# Altium schematic sheet ESP32.SchDoc
size A4; DocumentNumber: 4; SheetNumber: 4; SheetTotal: 8
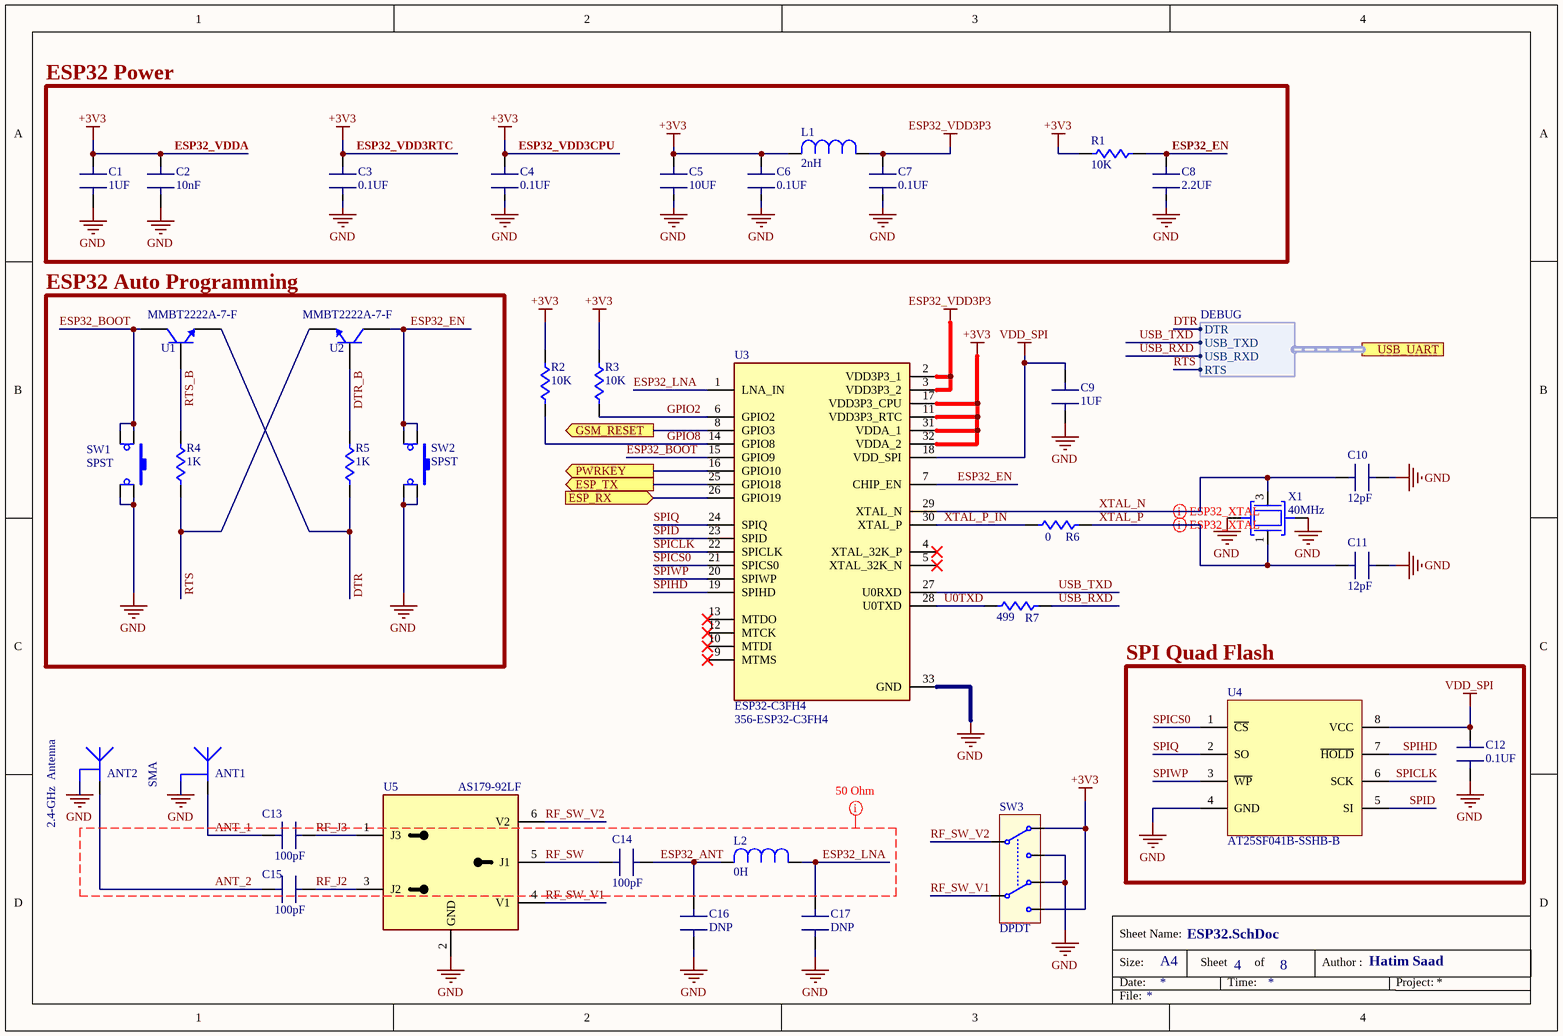
[diagram p0: ESP32.SchDoc]

## Parts
ANT1  SMA  [SMA RIGHT DIGIKEY]
ANT2  2.4-GHz  Antenna  [ANT_2.4_AN043]
C1  1UF  [CAP: 0603]
C2  10nF  [CAP: 0603]
C3  0.1UF  [CAP: 0603]
C4  0.1UF  [CAP: 0603]
C5  10UF  [CAP: 0805]
C6  0.1UF  [CAP: 0603]
C7  0.1UF  [CAP: 0603]
C8  2.2UF  [CAP: 0603]
C9  1UF  [CAP: 0603]
C10  12pF  [CAP: 0603]
C11  12pF  [CAP: 0603]
C12  0.1UF  [CAP: 0603]
C13  100pF  [CAP: 0603]
C14  100pF  [CAP: 0603]
C15  100pF  [CAP: 0603]
C16  DNP  [CAP: 0603]
C17  DNP  [CAP: 0603]
L1  2nH  [IND: 0603]
L2  0H  [IND: 0603]
R1  10K  [RES: 0603]
R2  10K  [RES: 0603]
R3  10K  [RES: 0603]
R4  1K  [RES: 0603]
R5  1K  [RES: 0603]
R6  0  [RES: 0603]
R7  499  [RES: 0603]
SW1  SPST  [Tactile Switch RKC2SJF170SMTRLFS]
SW2  SPST  [Tactile Switch RKC2SJF170SMTRLFS]
SW3  DPDT  [DPDT SWITCH]
U1  MMBT2222A-7-F  [SOT23_3]
U2  MMBT2222A-7-F  [SOT23_3]
U3  ESP32-C3FH4  Supplier Part Number 1: 356-ESP32-C3FH4  [QFN-32]
U4  AT25SF041B-SSHB-B  [8-SOIC]
U5  AS179-92LF  [SC70-6]
X1  40MHz  [4-SMD, No Lead ECS]

## Blocks framed on the sheet
ESP32 Power: C1-C8 L1 R1
ESP32 Auto Programming: R4 R5 SW1 SW2 U1 U2
SPI Quad Flash: C12 U4

## Ports
ESP_RX (in), ESP_TX (out), GSM_RESET (out), PWRKEY (out), USB_UART (harness DEBUG)

## Harnesses
DEBUG: DTR, USB_TXD, USB_RXD, RTS

## Nets
+3V3: C1.1(A) C2.1(A) C3.1(A) C4.1(A) C5.2(B) C6.1(A) L1.1 R1.1 R2.2 R3.2 SW3.1(B1) SW3.6(B2) U3.11(VDD3P3_RTC) U3.17(VDD3P3_CPU) U3.31(VDDA_1) U3.32(VDDA_2)
ESP32_VDD3P3: C7.1(A) L1.2 U3.2(VDD3P3_1) U3.3(VDD3P3_2)
GND: ANT1.2 ANT2.2 C1.2(B) C2.2(B) C3.2(B) C4.2(B) C5.1(A) C6.2(B) C7.2(B) C8.2(B) C9.2(B) C10.1(A) C11.1(A) C12.2(B) C16.2(B) C17.2(B) SW1.3 SW1.4 SW2.3 SW2.4 SW3.3(A1) SW3.4(A2) U3.33(GND) U4.4(GND) U5.2(GND) X1.2(GND) X1.4(GND)
VDD_SPI: C9.1(A) C12.1(A) U3.18(VDD_SPI) U4.8(VCC)
ANT_1: ANT1.1 C13.2(B)
ANT_2: ANT2.1 C15.2(B)
DTR: R5.2 U1.2(E) ; port USB_UART.DTR
DTR_B: R5.1 U2.1(B)
ESP32_ANT: C14.1(A) C16.1(A) L2.1
ESP32_BOOT: SW1.1 SW1.2 U1.3(C) U3.15(GPIO9)
ESP32_EN: C8.1(A) R1.2 SW2.1 SW2.2 U2.3(C) U3.7(CHIP_EN)
ESP32_LNA: C17.1(A) L2.2 U3.1(LNA_IN)
ESP_RX: U3.26(GPIO19) ; port ESP_RX
ESP_TX: U3.25(GPIO18) ; port ESP_TX
GPIO2: R3.1 U3.6(GPIO2)
GPIO8: R2.1 U3.14(GPIO8)
GSM_RESET: U3.8(GPIO3) ; port GSM_RESET
PWRKEY: U3.16(GPIO10) ; port PWRKEY
RF_J2: C15.1(A) U5.3(J2)
RF_J3: C13.1(A) U5.1(J3)
RF_SW: C14.2(B) U5.5(J1)
RF_SW_V1: SW3.5(COM2) U5.4(V1)
RF_SW_V2: SW3.2(COM1) U5.6(V2)
RTS: R4.2 U2.2(E) ; port USB_UART.RTS
RTS_B: R4.1 U1.1(B)
SPICLK: U3.22(SPICLK) U4.6(SCK)
SPICS0: U3.21(SPICS0) U4.1(~{CS})
SPID: U3.23(SPID) U4.5(SI)
SPIHD: U3.19(SPIHD) U4.7(~{HOLD})
SPIQ: U3.24(SPIQ) U4.2(SO)
SPIWP: U3.20(SPIWP) U4.3(~{WP})
U0TXD: R7.1 U3.28(U0TXD)
USB_RXD: R7.2 ; port USB_UART.USB_RXD
USB_TXD: U3.27(U0RXD) ; port USB_UART.USB_TXD
XTAL_N: C10.2(B) U3.29(XTAL_N) X1.3
XTAL_P: C11.2(B) R6.2 X1.1
XTAL_P_IN: R6.1 U3.30(XTAL_P)

Not connected (* = marked no-connect by the designer): U3 4(XTAL_32K_P)* 5(XTAL_32K_N)* 9(MTMS)* 10(MTDI)* 12(MTCK)* 13(MTDO)*

## Layout directives
differential pair: XTAL_N, XTAL_P
net class ANT: ANT_1, ANT_2, ESP32_ANT, ESP32_LNA, RF_J2, RF_J3, RF_SW

## Notes on the sheet
- (near C2) ESP32_VDDA
- (near C3) ESP32_VDD3RTC
- (near C4) ESP32_VDD3CPU
- Size:
- Date:
- Sheet Name:
- A4
- Sheet
- Time:
- of
- Author :
- Hatim Saad
- Project:
- File:

## Library data of the parts
ANT1 = SMA_1: Right Angled Female SMA Connector
ANT2 = ANT_2.4_AN043: Frequency 2.4 GHz             Typical Efficiency 68%               Bandwidth@ VSWR 2:0 101 MHz            Dimensions (mm) 15 x 8
C1-C4 C6-C17 = CAP 0603: CAP SMD 0603
C5 = CAP 0805: CAP SMD 0805
L1 L2 = IND 0603: IND SMD 0603
R1-R7 = RES 0603: RES SMD 0603
SW1 SW2 = RKC2SJF170SMTRLFS: Switch Tactile OFF-MOM SPST-NO Button J-Lead 12VDC 100000Cycles 500gf SMD T/R; Manufacturer: ITT C&K; Supplier 1: Mouser; Manufacturer Part Number: RKC2SJF170SMTRLFS; RoHS: No; Category: Tactile Switches; Stock 1: 16876; Pricing 1: 1=0.29, 10=0.285, 50=0.285, 100=0.246, 1000=0.177, 10000=0.152 (USD); Supplier Part Number 1: 611-RKC2SJF170SMRLFS
SW3 = MST22D18G2 125: Swicth DPDT 0.1A 12V 10000 SMD Slide Switches
U1 U2 = MMBT2222A-7-F: MMBT2222 Series NPN 350 mW 40 V 600 mA SMT Small Signal Transistor - SOT-23; Manufacturer: Diodes; hFE Min: 100; Frequency: 300MHz; Max Power Dissipation: 300mW; Number of Elements: 1; Collector Emitter Voltage (VCEO): 40V; Collector Base Voltage (VCBO): 75V; Emitter Base Voltage (VEBO): 6V; Collector Emitter Saturation Voltage: 1V; Max Collector Current: 600mA; Power Dissipation: 350mW; Current: 1A; Supplier 1: Mouser; Manufacturer Part Number: MMBT2222A-7-F; RoHS: Yes; Category: BJTs; Stock 1: 1332144; Pricing 1: 1=0.14, 10=0.097, 50=0.097, 100=0.041, 1000=0.028, 10000=0.016 (USD); Mount: Surface Mount; Case/Package: SOT-23; Number of Pins: 3; Weight: 0.000282oz; Min Operating Temperature: -55°C; Max Operating Temperature: 150°C; Polarity: NPN; Packaging: Tape and Reel; Package Quantity: 3000; Continuous Collector Current: 600mA; Collector Emitter Breakdown Voltage: 40V; Transition Frequency: 300MHz; Max Breakdown Voltage: 40V; Max Frequency: 300MHz; Termination: SMD/SMT; Gain Bandwidth Product: 300MHz; Voltage Rating (DC): 40V; Current Rating: 600mA; Voltage: 40V; Collector-emitter Voltage-Max: 1V; Series: Automotive, AEC-Q101; Length: 3.05mm; Width: 1.4mm; Height: 1mm; Radiation Hardening: No; Reach SVHC Compliant: No; Lead Free: Lead Free; RoHS Compliant: Yes; ComponentLink1URL: https://datasheet.ciiva.com/15139/getdatasheetpartid-82692-15139078.pdf?src-supplier=Verical; ComponentLink1Description: https://datasheet.ciiva.com/15139/getdatasheetpartid-82692-15139078.pdf?src-supplier=Verical; ComponentLink2URL: https://datasheet.ciiva.com/8029/ds30041-8029709.pdf?src-supplier=Element14; ComponentLink2Description: https://datasheet.ciiva.com/8029/ds30041-8029709.pdf?src-supplier=Element14; ComponentLink3URL: https://datasheet.ciiva.com/11201/ds30041-11201864.pdf?src-supplier=Avnet; ComponentLink3Description: https://datasheet.ciiva.com/11201/ds30041-11201864.pdf?src-supplier=Avnet; ComponentLink4URL: https://datasheet.ciiva.com/16199/ds30041-16199045.pdf?src-supplier=Future+Electronics; ComponentLink4Description: https://datasheet.ciiva.com/16199/ds30041-16199045.pdf?src-supplier=Future+Electronics; ComponentLink5URL: https://datasheet.ciiva.com/11198/ds30041-11198965.pdf?src-supplier=Avnet; ComponentLink5Description: https://datasheet.ciiva.com/11198/ds30041-11198965.pdf?src-supplier=Avnet; ComponentLink6URL: https://datasheet.ciiva.com/972/ds30041-972551.pdf?src-supplier=Digi-Key; ComponentLink6Description: https://datasheet.ciiva.com/972/ds30041-972551.pdf?src-supplier=Digi-Key; ComponentLink7URL: https://datasheet.ciiva.com/972/ds30041-972552.pdf?src-supplier=Digi-Key; ComponentLink7Description: https://datasheet.ciiva.com/972/ds30041-972552.pdf?src-supplier=Digi-Key; ComponentLink8URL: https://datasheet.ciiva.com/972/ds30041-972550.pdf?src-supplier=Digi-Key; ComponentLink8Description: https://datasheet.ciiva.com/972/ds30041-972550.pdf?src-supplier=Digi-Key; Supplier Part Number 1: 621-MMBT2222A-F
U3 = ESP32-C3FH4: SoC 32-Bit RISC 160MHz Single Core 4MB 32-Pin QFN T/R; Manufacturer: Espressif Systems; Supplier 1: Mouser; Manufacturer Part Number: ESP32-C3FH4; RoHS: No; Stock 1: 6949; Pricing 1: 1=1.3, 10=1.3, 50=1.3, 100=1.3, 1000=1.3, 10000=1.3 (USD)
U4 = AT25SF041B-SSHB-B: NOR Flash Serial (SPI, Dual SPI, Quad SPI) 3.3V 4M-bit 512K x 8 7ns Tube; Manufacturer: Renesas; Supplier: Mouser; Supplier Part Number: 988-AT25SF041-SSH-B; Manufacturer Part Number: AT25SF041B-SSHB-B; RoHS: No; Category: Memory; Stock: 14517; Pricing: 1=0.42, 10=0.38, 50=0.38, 100=0.333, 1000=0.326, 10000=0.287 (USD); Supplier 1: Mouser; Supplier Part Number 1: 988-AT25SF041-SSH-B
U5 = AS179-92LF: RF Switch SPDT 0.02MHz to 4GHz 20dB Automotive 6-Pin SC-88 T/R / IC SW SPDT DC-3GHZ GAAS SC70-6; Manufacturer: Skyworks Solutions; Supplier: Mouser; Supplier Part Number: 873-AS179-92LF; Manufacturer Part Number: AS179-92LF; RoHS: Yes; Category: Integrated Circuits (ICs); Stock: 56001; Pricing: 1=1.19, 10=1.02, 50=1.02, 100=0.778, 1000=0.543, 10000=0.462 (USD); ComponentLink1URL: https://datasheet.ciiva.com/12080/200176g-18773-12080182.pdf?src-supplier=Mouser; ComponentLink1Description: https://datasheet.ciiva.com/12080/200176g-18773-12080182.pdf?src-supplier=Mouser; ComponentLink2URL: https://datasheet.ciiva.com/15100/getdatasheetpartid-658205-15100462.pdf?src-supplier=Verical; ComponentLink2Description: https://datasheet.ciiva.com/15100/getdatasheetpartid-658205-15100462.pdf?src-supplier=Verical; ComponentLink3URL: https://datasheet.ciiva.com/22694/1909043-22694026.pdf?src-supplier=Element14; ComponentLink3Description: https://datasheet.ciiva.com/22694/1909043-22694026.pdf?src-supplier=Element14; ComponentLink4URL: https://datasheet.ciiva.com/2799/200176g-2799448.pdf?src-supplier=Digi-Key; ComponentLink4Description: https://datasheet.ciiva.com/2799/200176g-2799448.pdf?src-supplier=Digi-Key; ComponentLink5URL: https://datasheet.ciiva.com/2799/200176g-2799449.pdf?src-supplier=Digi-Key; ComponentLink5Description: https://datasheet.ciiva.com/2799/200176g-2799449.pdf?src-supplier=Digi-Key; ComponentLink6URL: https://datasheet.ciiva.com/2799/200176g-2799450.pdf?src-supplier=Digi-Key; ComponentLink6Description: https://datasheet.ciiva.com/2799/200176g-2799450.pdf?src-supplier=Digi-Key; Supplier 1: Mouser; Supplier Part Number 1: 873-AS179-92LF
X1 = ECS-400-10-37B2-CKY-TR: Crystal 40MHz 10pF 4-Pin SMD ECX-1637B2 T/R; Manufacturer: ECS International; Supplier 1: Mouser; Manufacturer Part Number: ECS-400-10-37B2-CKY-TR; RoHS: No; Category: Uncategorized; Stock 1: 5766; Pricing 1: 1=0.38, 10=0.285, 50=0.285, 100=0.253, 1000=0.203, 10000=0.176 (USD); Supplier Part Number 1: 520-400-10-37B2CKYTR